# EAGLE design Final Standalone Arduino (EAGLE 9.4.0)
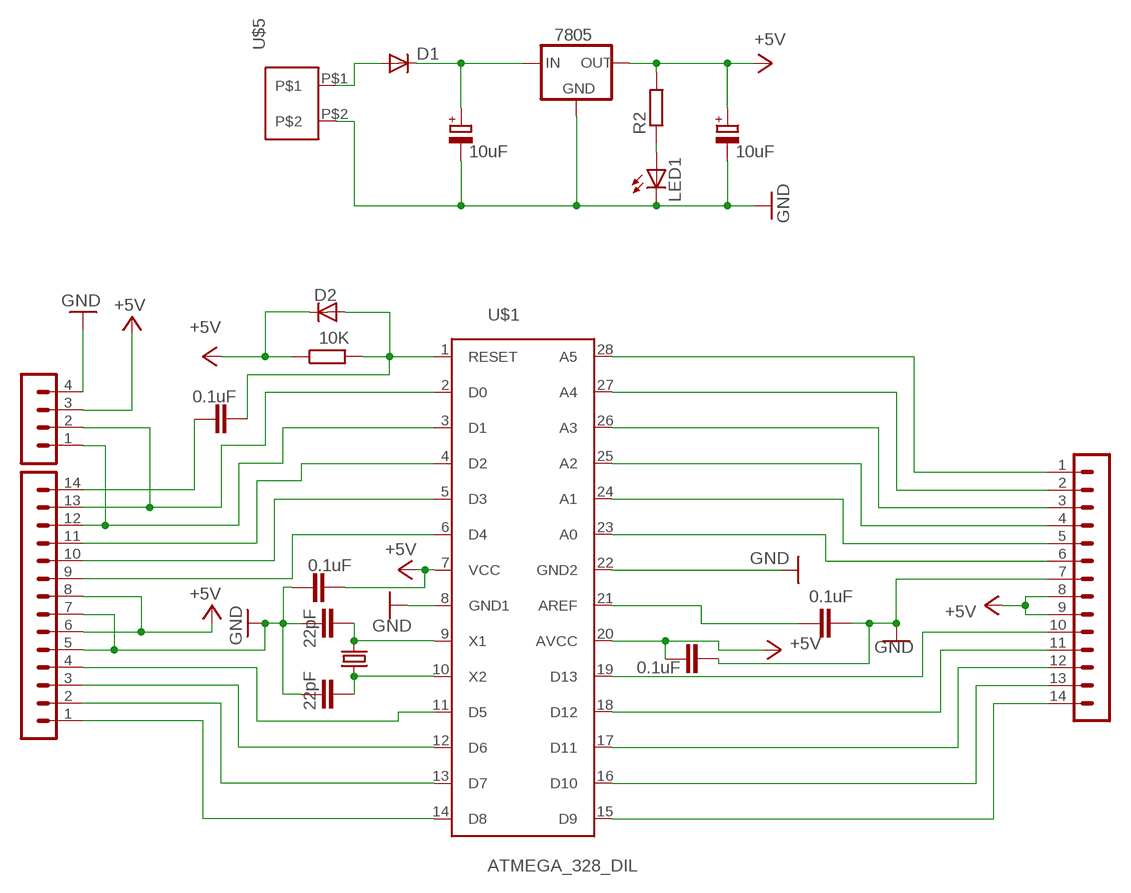
[diagram p0: schematic, sheet 1]

## Parts
C1  22pF  C-EU025-024X044  [C025-024X044]
C2  22pF  C-EU025-024X044  [C025-024X044]
C3  0.1uF  C-EU025-024X044  [C025-024X044]
C4  10uF  CPOL-EUE2-5  [E2-5]
C5  0.1uF  C-EU025-024X044  [C025-024X044]
C6  0.1uF  C-EU025-024X044  [C025-024X044]
C7  0.1uF  C-EU025-024X044  [C025-024X044]
C9  10uF  CPOL-EUE2-5  [E2-5]
D1  DIODE-D-7.5  [D-7.5]
D2  DIODE-D-7.5  [D-7.5]
IC2  7805  78XXL  [78XXL]
LED1  LED5MM  [LED5MM]
R1  10K  R-EU_0207/10  [0207/10]
R2  R-EU_0207/10  [0207/10]
U$1  ATMEGA_328_DIL  [ATMEGA_328_DIL]
U$2  14_PIN_CONN  [14_PIN_CONN]
U$3  14_PIN_CONN  [14_PIN_CONN]
U$4  4_PIN_CONN  [4_PIN_CONN]
U$5  2_PIN_SCREW_CONN  [2_PIN_SCREW_CONN]
Y1  CRYSTALHC49UV  [HC49U-V]

## Nets
9V [power]: D1.A U$5.P$1
+5V [power]: C3.2 C5.2 C9.+ D2.C IC2.OUT R1.1 R2.2 U$1.7(VCC) U$1.20(AVCC) U$2.6 U$2.8 U$3.8 U$3.9 U$4.3
GND [power]: C1.1 C2.1 C3.1 C4.- C5.1 C7.1 C9.- IC2.GND LED1.K(C) U$1.8(GND1) U$1.22(GND2) U$2.5 U$2.7 U$3.7 U$4.4 U$5.P$2
N$1: C6.2 D2.A R1.2 U$1.1(RESET)
N$2: C1.2 U$1.9(X1) Y1.2
N$3: C2.2 U$1.10(X2) Y1.1
N$4: U$1.2(D0) U$2.13 U$4.2
N$5: U$1.3(D1) U$2.12 U$4.1
N$6: U$1.4(D2) U$2.11
N$7 [power]: C4.+ D1.C IC2.IN
N$8: U$1.6(D4) U$2.9
N$9: LED1.A R2.1
N$10: U$1.28(A5) U$3.1
N$11: U$1.27(A4) U$3.2
N$12: U$1.26(A3) U$3.3
N$13: U$1.25(A2) U$3.4
N$14: U$1.24(A1) U$3.5
N$15: U$1.23(A0) U$3.6
N$16: U$1.15(D9) U$3.14
N$17: U$1.16(D10) U$3.13
N$18: U$1.17(D11) U$3.12
N$19: U$1.18(D12) U$3.11
N$20: U$1.19(D13) U$3.10
N$21: U$1.14(D8) U$2.1
N$22: U$1.13(D7) U$2.2
N$23: U$1.12(D6) U$2.3
N$24: U$1.11(D5) U$2.4
N$25: C6.1 U$2.14
N$26: U$1.5(D3) U$2.10
N$27: C7.2 U$1.21(AREF)

## Library data of the parts
C1-C3 C5-C7 = resistor:C-EU: CAPACITOR, European symbol
C4 C9 = resistor:CPOL-EU: POLARIZED CAPACITOR, European symbol
D1 D2 = diode:DIODE-: DIODE
IC2 = v-reg:78XXL: VOLTAGE REGULATOR
LED1 = led:LED: LED OSRAM: - CHIPLED LG R971, LG N971, LY N971, LG Q971, LY Q971, LO R971, LY R971 LH N974, LH R974 LS Q976, LO Q976, LY Q976 LO Q996 - Hyper CHIPLED LW Q18S LB Q993, LB Q99A, LB R99A - SideLED LS A670, LO A670, LY A670, LG A670, LP A670 LB A673, LV A673, LT A673, LW A673 LH A674 LY A675 LS A676, LA A676, LO A676, LY A676, LW A676 LS A679, LY A679, LG A679 - Hyper Micro SIDELED® LS Y876, LA Y876, LO Y876, LY Y876 LT Y87S - SmartLED LW L88C, LW L88S LB L89C, LB L89S, LG L890 LS L89K, LO L89K, LY L89K LS L896, LA L896, LO L896, LY L896 - TOPLED LS T670, LO T670, LY T670, LG T670, LP T670 LSG T670, LSP T670, LSY T670, LOP T670, LYG T670 LG T671, LOG T671, LSG T671 LB T673, LV T673, LT T673, LW T673 LH T674 LS T676, LA T676, LO T676, LY T676, LB T676, LH T676, LSB T676, LW T676 LB T67C, LV T67C, LT T67C, LS T67K, LO T67K, LY T67K, LW E67C LS E67B, LA E67B, LO E67B, LY E67B, LB E67C, LV E67C, LT E67C LW T67C LS T679, LY T679, LG T679 LS T770, LO T770, LY T770, LG T770, LP T770 LB T773, LV T773, LT T773, LW T773 LH T774 LS E675, LA E675, LY E675, LS T675 LS T776, LA T776, LO T776, LY T776, LB T776 LHGB T686 LT T68C, LB T68C - Hyper Mini TOPLED® LB M676 - Mini TOPLED Santana® LG M470 LS M47K, LO M47K, LY M47K Source: http://www.osram.convergy.de LUXEON: - LUMILED® LXK2-PW12-R00, LXK2-PW12-S00, LXK2-PW14-U00, LXK2-PW14-V00 LXK2-PM12-R00, LXK2-PM12-S00, LXK2-PM14-U00 LXK2-PE12-Q00, LXK2-PE12-R00, LXK2-PE12-S00, LXK2-PE14-T00, LXK2-PE14-U00 LXK2-PB12-K00, LXK2-PB12-L00, LXK2-PB12-M00, LXK2-PB14-N00, LXK2-PB14-P00, LXK2-PB14-Q00 LXK2-PR12-L00, LXK2-PR12-M00, LXK2-PR14-Q00, LXK2-PR14-R00 LXK2-PD12-Q00, LXK2-PD12-R00, LXK2-PD12-S00 LXK2-PH12-R00, LXK2-PH12-S00 LXK2-PL12-P00, LXK2-PL12-Q00, LXK2-PL12-R00 Source: www.luxeon.com KINGBRIGHT: KA-3528ASYC Source: www.kingbright.com
R1 R2 = resistor:R-EU_: RESISTOR, European symbol
U$1 = Atmega_328_DIL:ATMEGA_328_DIL
U$2 U$3 = 14_PIN_CONN:14_PIN_CONN
U$4 = 4_PIN_CONN:4_PIN_CONN
U$5 = 2 Pin screw Conn:2_PIN_SCREW_CONN
Y1 = SparkFun-FreqCtrl:CRYSTAL: Various standard crystals. Proven footprints. Spark Fun Electronics SKU : COM-00534

## Net classes
0 default: width 0.254 mm, drill 0.305 mm, clearance 0.254 mm
1 power: width 0.61 mm, drill 0.66 mm, clearance 0.254 mm

## Board
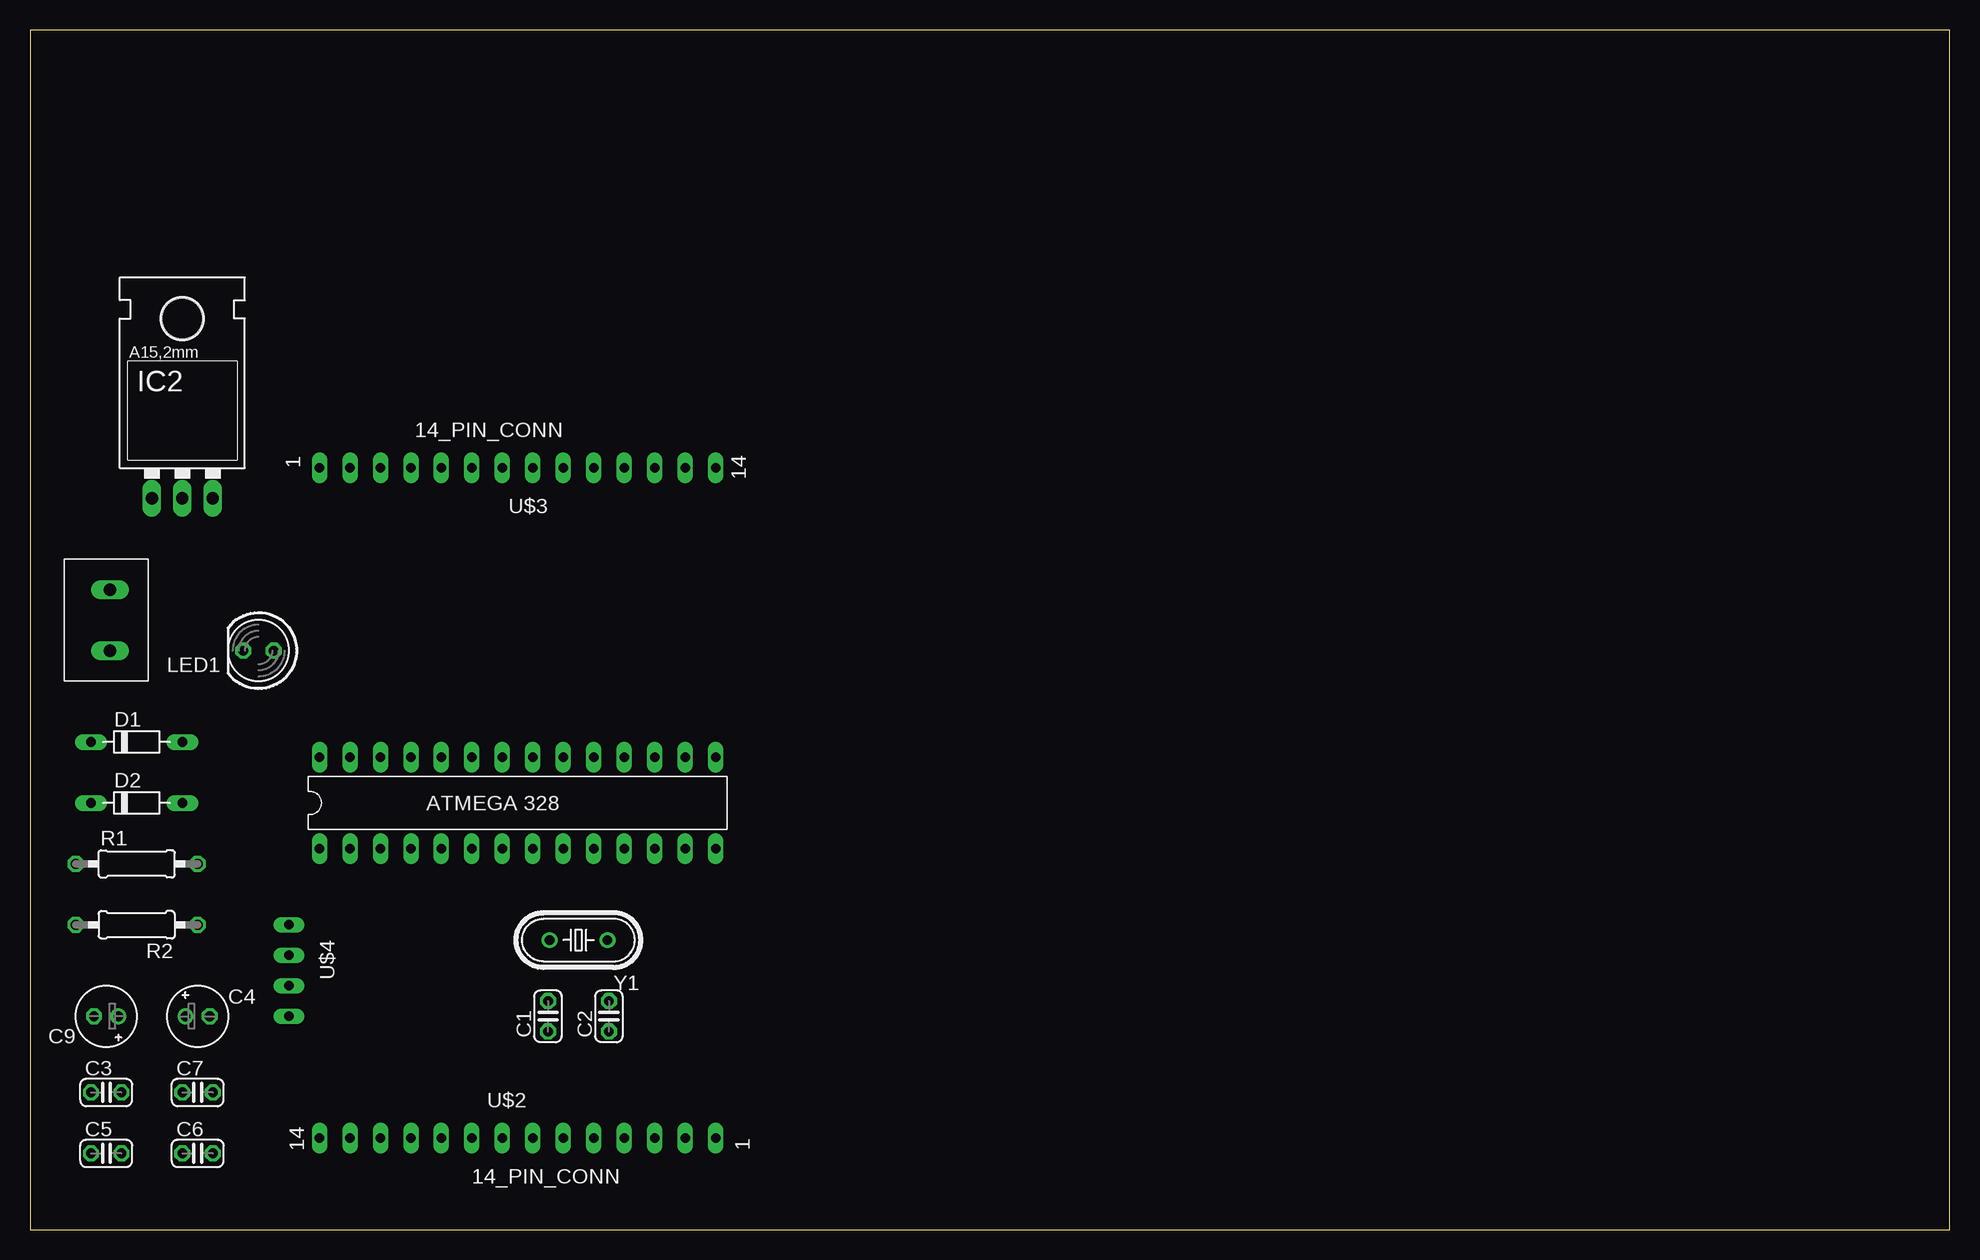
[diagram p1: board, top side]
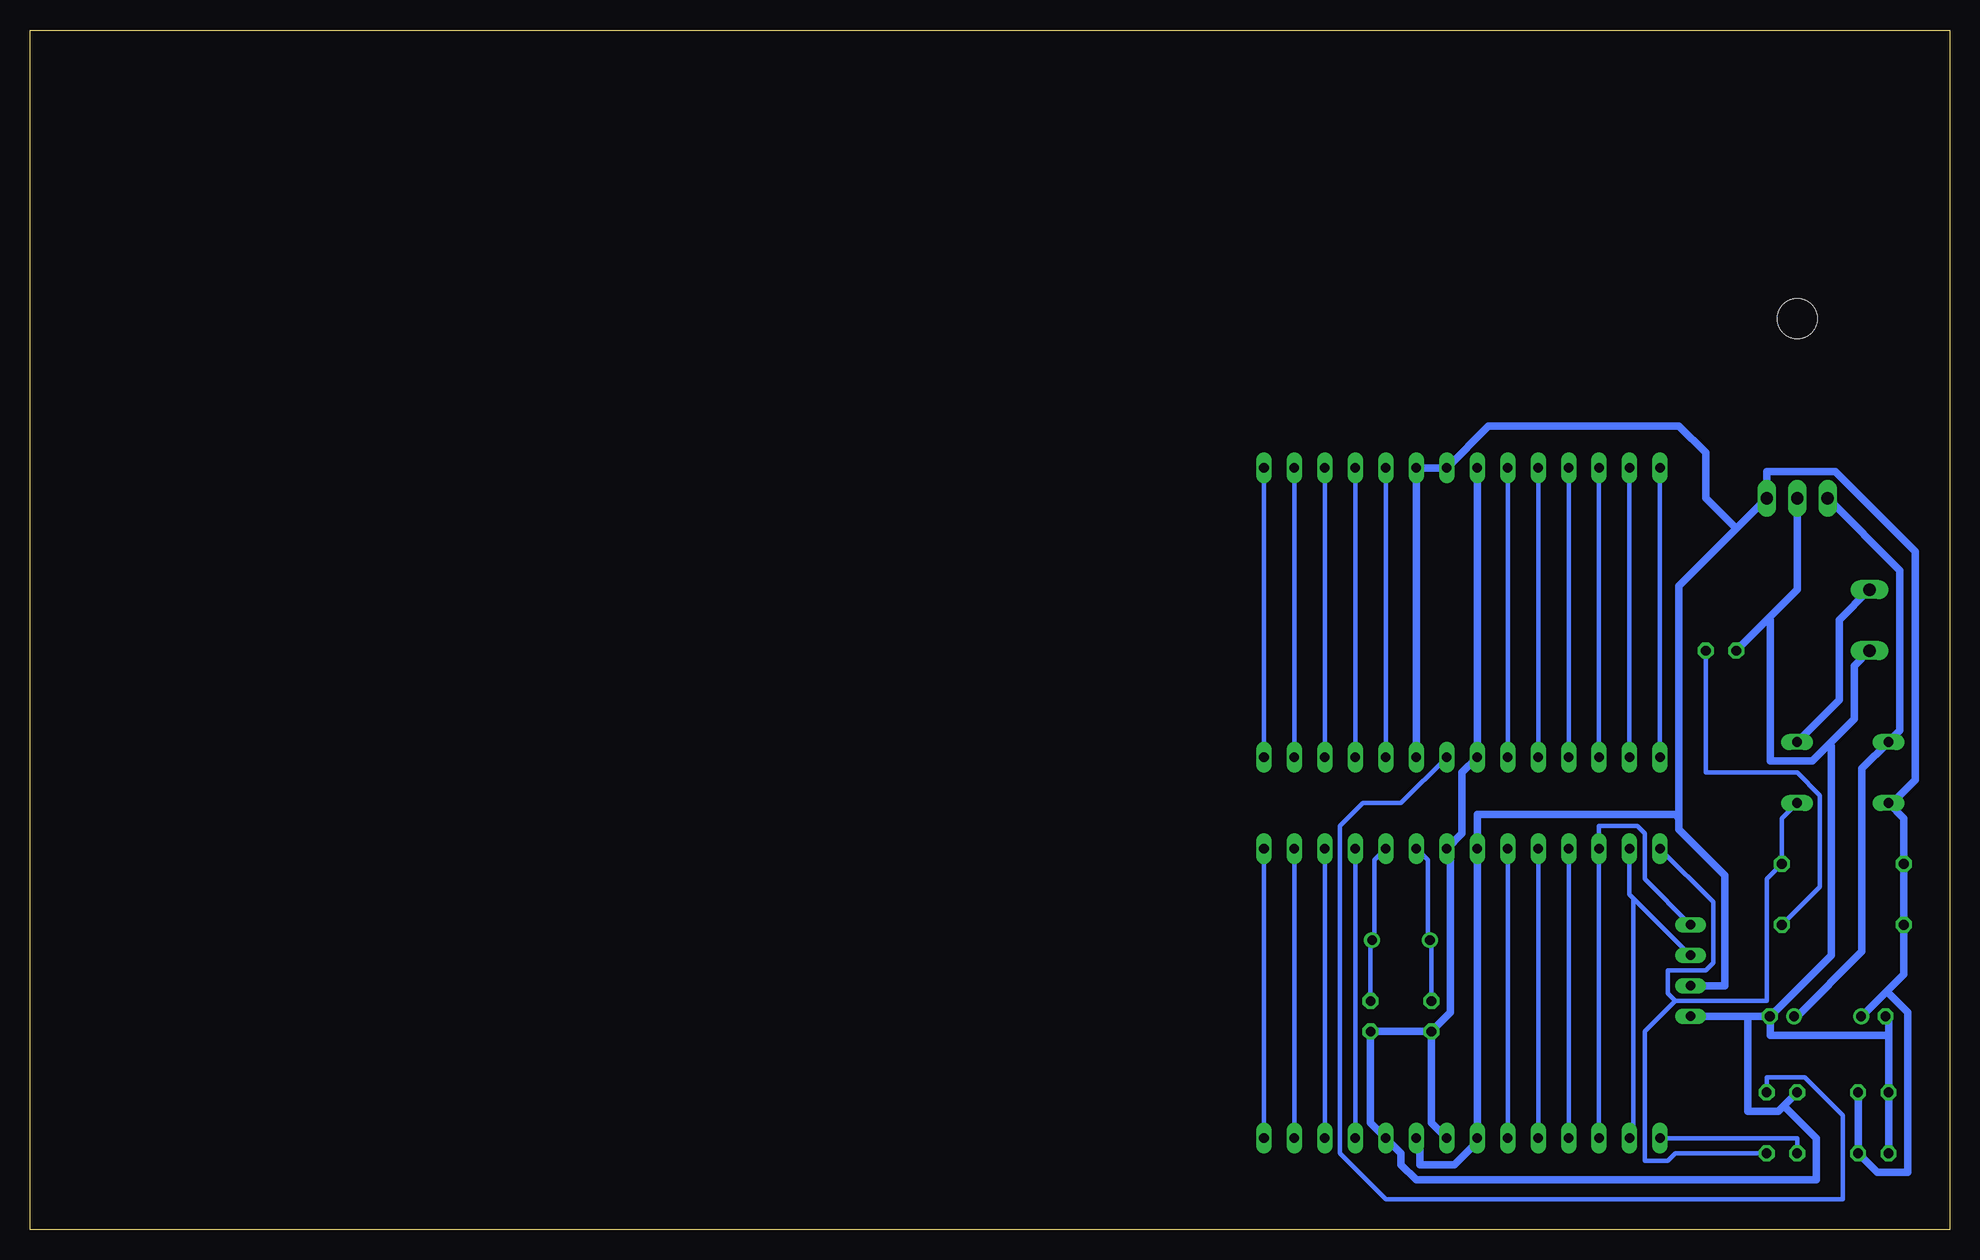
[diagram p2: board, bottom side, seen from below]

Size 160 x 100 mm. Coordinates in mm from the lower left corner, seen from the top.
Outline: 0,0 160,0 160,100 0,100 0,0
Copper layers (1*16): Top 0.035mm / dielectric 1.5mm / Bottom 0.035mm
Design rules "default *": minimum track width 15mil, minimum drill 0.35mm, track to track 15mil, track to pad 15mil, pad to pad 6mil, via to via 6mil, smd to smd 6mil, copper to edge 40mil, drill to drill 6mil, minimum pad ring 10mil, minimum via ring 8mil, stop-mask expansion 4mil, vias tented up to drill 0mil, thermal gap 10mil

### Footprints (pad centres in the part's own frame; a part is rotated, then mirrored left to right if it is on the bottom)
C025-024X044 = drill 0.813 octagon: 1 -1.27,0; 2 1.27,0
E2-5 = drill 0.813 pad 1.27: + -1.016,0 | drill 0.813 pad 1.27 octagon: - 1.016,0
D-7.5 = drill 0.813 long: A 3.81,0; C -3.81,0
78XXL = drill 1.016 long: GND 0,-3.81; IN -2.54,-3.81; OUT 2.54,-3.81 | hole 3.302: 0,11.176
LED5MM = drill 0.813 octagon: A -1.27,0; K 1.27,0
0207/10 = drill 0.813 octagon: 1 -5.08,0; 2 5.08,0
ATMEGA_328_DIL = drill 0.8 long: 1 -16.51,-3.81; 2 -13.97,-3.81; 3 -11.43,-3.81; 4 -8.89,-3.81; 5 -6.35,-3.81; 6 -3.81,-3.81; 7 -1.27,-3.81; 8 1.27,-3.81; 9 3.81,-3.81; 10 6.35,-3.81; 11 8.89,-3.81; 12 11.43,-3.81; 13 13.97,-3.81; 14 16.51,-3.81; 15 16.51,3.81; 16 13.97,3.81; 17 11.43,3.81; 18 8.89,3.81; 19 6.35,3.81; 20 3.81,3.81; 21 1.27,3.81; 22 -1.27,3.81; 23 -3.81,3.81; 24 -6.35,3.81; 25 -8.89,3.81; 26 -11.43,3.81; 27 -13.97,3.81; 28 -16.51,3.81
14_PIN_CONN = drill 0.8 long: 1 -16.51,0; 2 -13.97,0; 3 -11.43,0; 4 -8.89,0; 5 -6.35,0; 6 -3.81,0; 7 -1.27,0; 8 1.27,0; 9 3.81,0; 10 6.35,0; 11 8.89,0; 12 11.43,0; 13 13.97,0; 14 16.51,0
4_PIN_CONN = drill 0.8 long: 1 -3.81,0; 2 -1.27,0; 3 1.27,0; 4 3.81,0
2_PIN_SCREW_CONN = drill 1.05 long: P$1 -2.54,0.318; P$2 2.54,0.318
HC49U-V = drill 0.813: 1 -2.413,0; 2 2.413,0

### Placement (x,y rotation side)
C1  43.18,17.78 90 top
C2  48.26,17.78 90 top
C3  6.35,11.43 0 top
C4  13.97,17.78 0 top
C5  6.35,6.35 0 top
C6  13.97,6.35 0 top
C7  13.97,11.43 0 top
C9  6.35,17.78 180 top
D1  8.89,40.64 0 top
D2  8.89,35.56 0 top
IC2  12.7,64.77 0 top
LED1  19.05,48.26 180 top
R1  8.89,30.48 0 top
R2  8.89,25.4 180 top
U$1  40.64,35.56 0 top
U$2  40.64,7.62 180 top
U$3  40.64,63.5 0 top
U$4  21.59,21.59 270 top
U$5  6.35,50.8 270 top
Y1  45.72,24.13 180 top

### Tracks (layer width: path | path; a pad name or v marks a point on that pad's centre or on a via)
9V
  Bottom 0.61: D1.A 9.21,44.13 9.21,50.8 U$5.P$1
+5V
  Bottom 0.61: C3.2 C5.2 6.03,4.76 3.49,4.76 3.49,18.1 5.24,19.84 | 5.24,19.84 3.81,21.27 R2.2 R1.1 3.81,34.29 D2.C 4.76,35.56 2.86,37.47 2.86,56.52 9.52,63.18 15.24,63.18 IC2.OUT 17.78,58.42 | 5.24,19.84 7.3,17.78 C9.+ | U$1.20 U$3.9 U$3.8 38.42,66.99 25.4,66.99 24.76,66.99 22.54,66.99 20.32,64.77 20.32,60.96 17.78,58.42 | U$2.6 44.13,7.3 44.13,5.4 41.28,5.4 39.37,7.3 U$2.8 U$1.7 39.37,34.61 22.86,34.61 22.54,34.29 | U$4.3 18.73,20.32 18.73,29.53 22.54,33.34 22.54,34.29 | 17.78,58.42 22.54,53.66 22.54,34.29
GND
  Bottom 0.61: U$2.7 43.18,8.89 C1.1 | C1.1 C2.1 48.26,8.89 U$2.5 45.72,6.35 45.72,5.4 44.45,4.13 11.11,4.13 11.11,7.62 13.81,10.32 | U$3.7 U$1.22 40.64,38.1 40.64,33.02 U$1.8 41.59,31.75 41.59,18.1 C1.1 | C5.1 C3.1 5.08,16.19 | 5.08,16.19 5.08,17.78 C9.- | 16.83,17.78 C4.- 14.92,17.78 | 16.83,17.78 U$4.4 | 13.81,10.32 14.29,9.84 16.83,9.84 16.83,17.78 | 13.81,10.32 C7.1 | 5.08,16.19 14.92,16.19 14.92,17.78 | 15.08,50.96 12.7,53.34 IC2.GND | 15.08,50.96 LED1.K | U$5.P$2 7.94,46.99 7.94,42.55 10,40.48 | 10,40.48 11.43,39.05 14.92,39.05 14.92,50.8 15.08,50.96 | 14.92,17.78 9.84,22.86 9.84,40.32 10,40.48
N$1
  Bottom 0.381: U$1.1 19.68,27.3 19.68,22.22 20.32,21.59 23.49,21.59 23.49,19.68 22.86,19.05 | 22.86,19.05 15.24,19.05 15.24,29.21 R1.2 13.97,34.29 D2.A | C6.2 22.86,6.35 23.49,5.71 25.4,5.71 25.4,16.51 22.86,19.05
N$2
  Bottom 0.381: U$1.9 43.5,30.8 43.5,24.13 Y1.2 43.18,24.13 C1.2
N$3
  Bottom 0.381: U$1.10 47.94,30.8 47.94,24.13 Y1.1 48.26,24.13 C2.2
N$4
  Bottom 0.381: 26.35,27.62 26.67,27.94 U$1.2 | 26.35,27.62 U$4.2 | U$2.13 26.35,7.94 26.35,27.62
N$5
  Bottom 0.381: U$4.1 25.4,29.21 25.4,33.02 26.04,33.66 29.21,33.66 U$1.3 U$2.12
N$6
  Bottom 0.381: U$1.4 U$2.11
N$7
  Bottom 0.61: C4.+ 12.7,17.78 7.3,23.18 7.3,38.42 D1.C 4.13,41.59 4.13,54.93 IC2.IN
N$8
  Bottom 0.381: U$1.6 U$2.9
N$9
  Bottom 0.381: R2.1 10.79,28.57 10.79,36.2 12.7,38.1 20.32,38.1 LED1.A
N$10
  Bottom 0.381: U$3.1 U$1.28
N$11
  Bottom 0.381: U$3.2 U$1.27
N$12
  Bottom 0.381: U$3.3 U$1.26
N$13
  Bottom 0.381: U$3.4 U$1.25
N$14
  Bottom 0.381: U$3.5 U$1.24
N$15
  Bottom 0.381: U$3.6 U$1.23
N$16
  Bottom 0.381: U$3.14 U$1.15
N$17
  Bottom 0.381: U$3.13 U$1.16
N$18
  Bottom 0.381: U$3.12 U$1.17
N$19
  Bottom 0.381: U$3.11 U$1.18
N$20
  Bottom 0.381: U$3.10 U$1.19
N$21
  Bottom 0.381: U$1.14 U$2.1
N$22
  Bottom 0.381: U$1.13 U$2.2
N$23
  Bottom 0.381: U$1.12 U$2.3
N$24
  Bottom 0.381: U$1.11 U$2.4
N$25
  Bottom 0.381: U$2.14 12.7,7.62 C6.1
N$26
  Bottom 0.381: U$1.5 U$2.10
N$27
  Bottom 0.381: C7.2 15.24,12.7 12.06,12.7 8.89,9.53 8.89,2.54 46.99,2.54 50.8,6.35 50.8,33.66 48.9,35.56 45.72,35.56 U$1.21